# EasyEDA Pro project ProPrj_optical-usb-serial-port-module_2025-04-07.epro

# Schematic Schematic1
Board Name: Board1; Create Date: 2025-04-07; Page Name: P1; Project Name: 光纤USB串口模块; Schematic Name: Schematic1; Update Date: 2025-04-13; Company: 嘉立创EDA; Page Size: A4; Version: V1.0
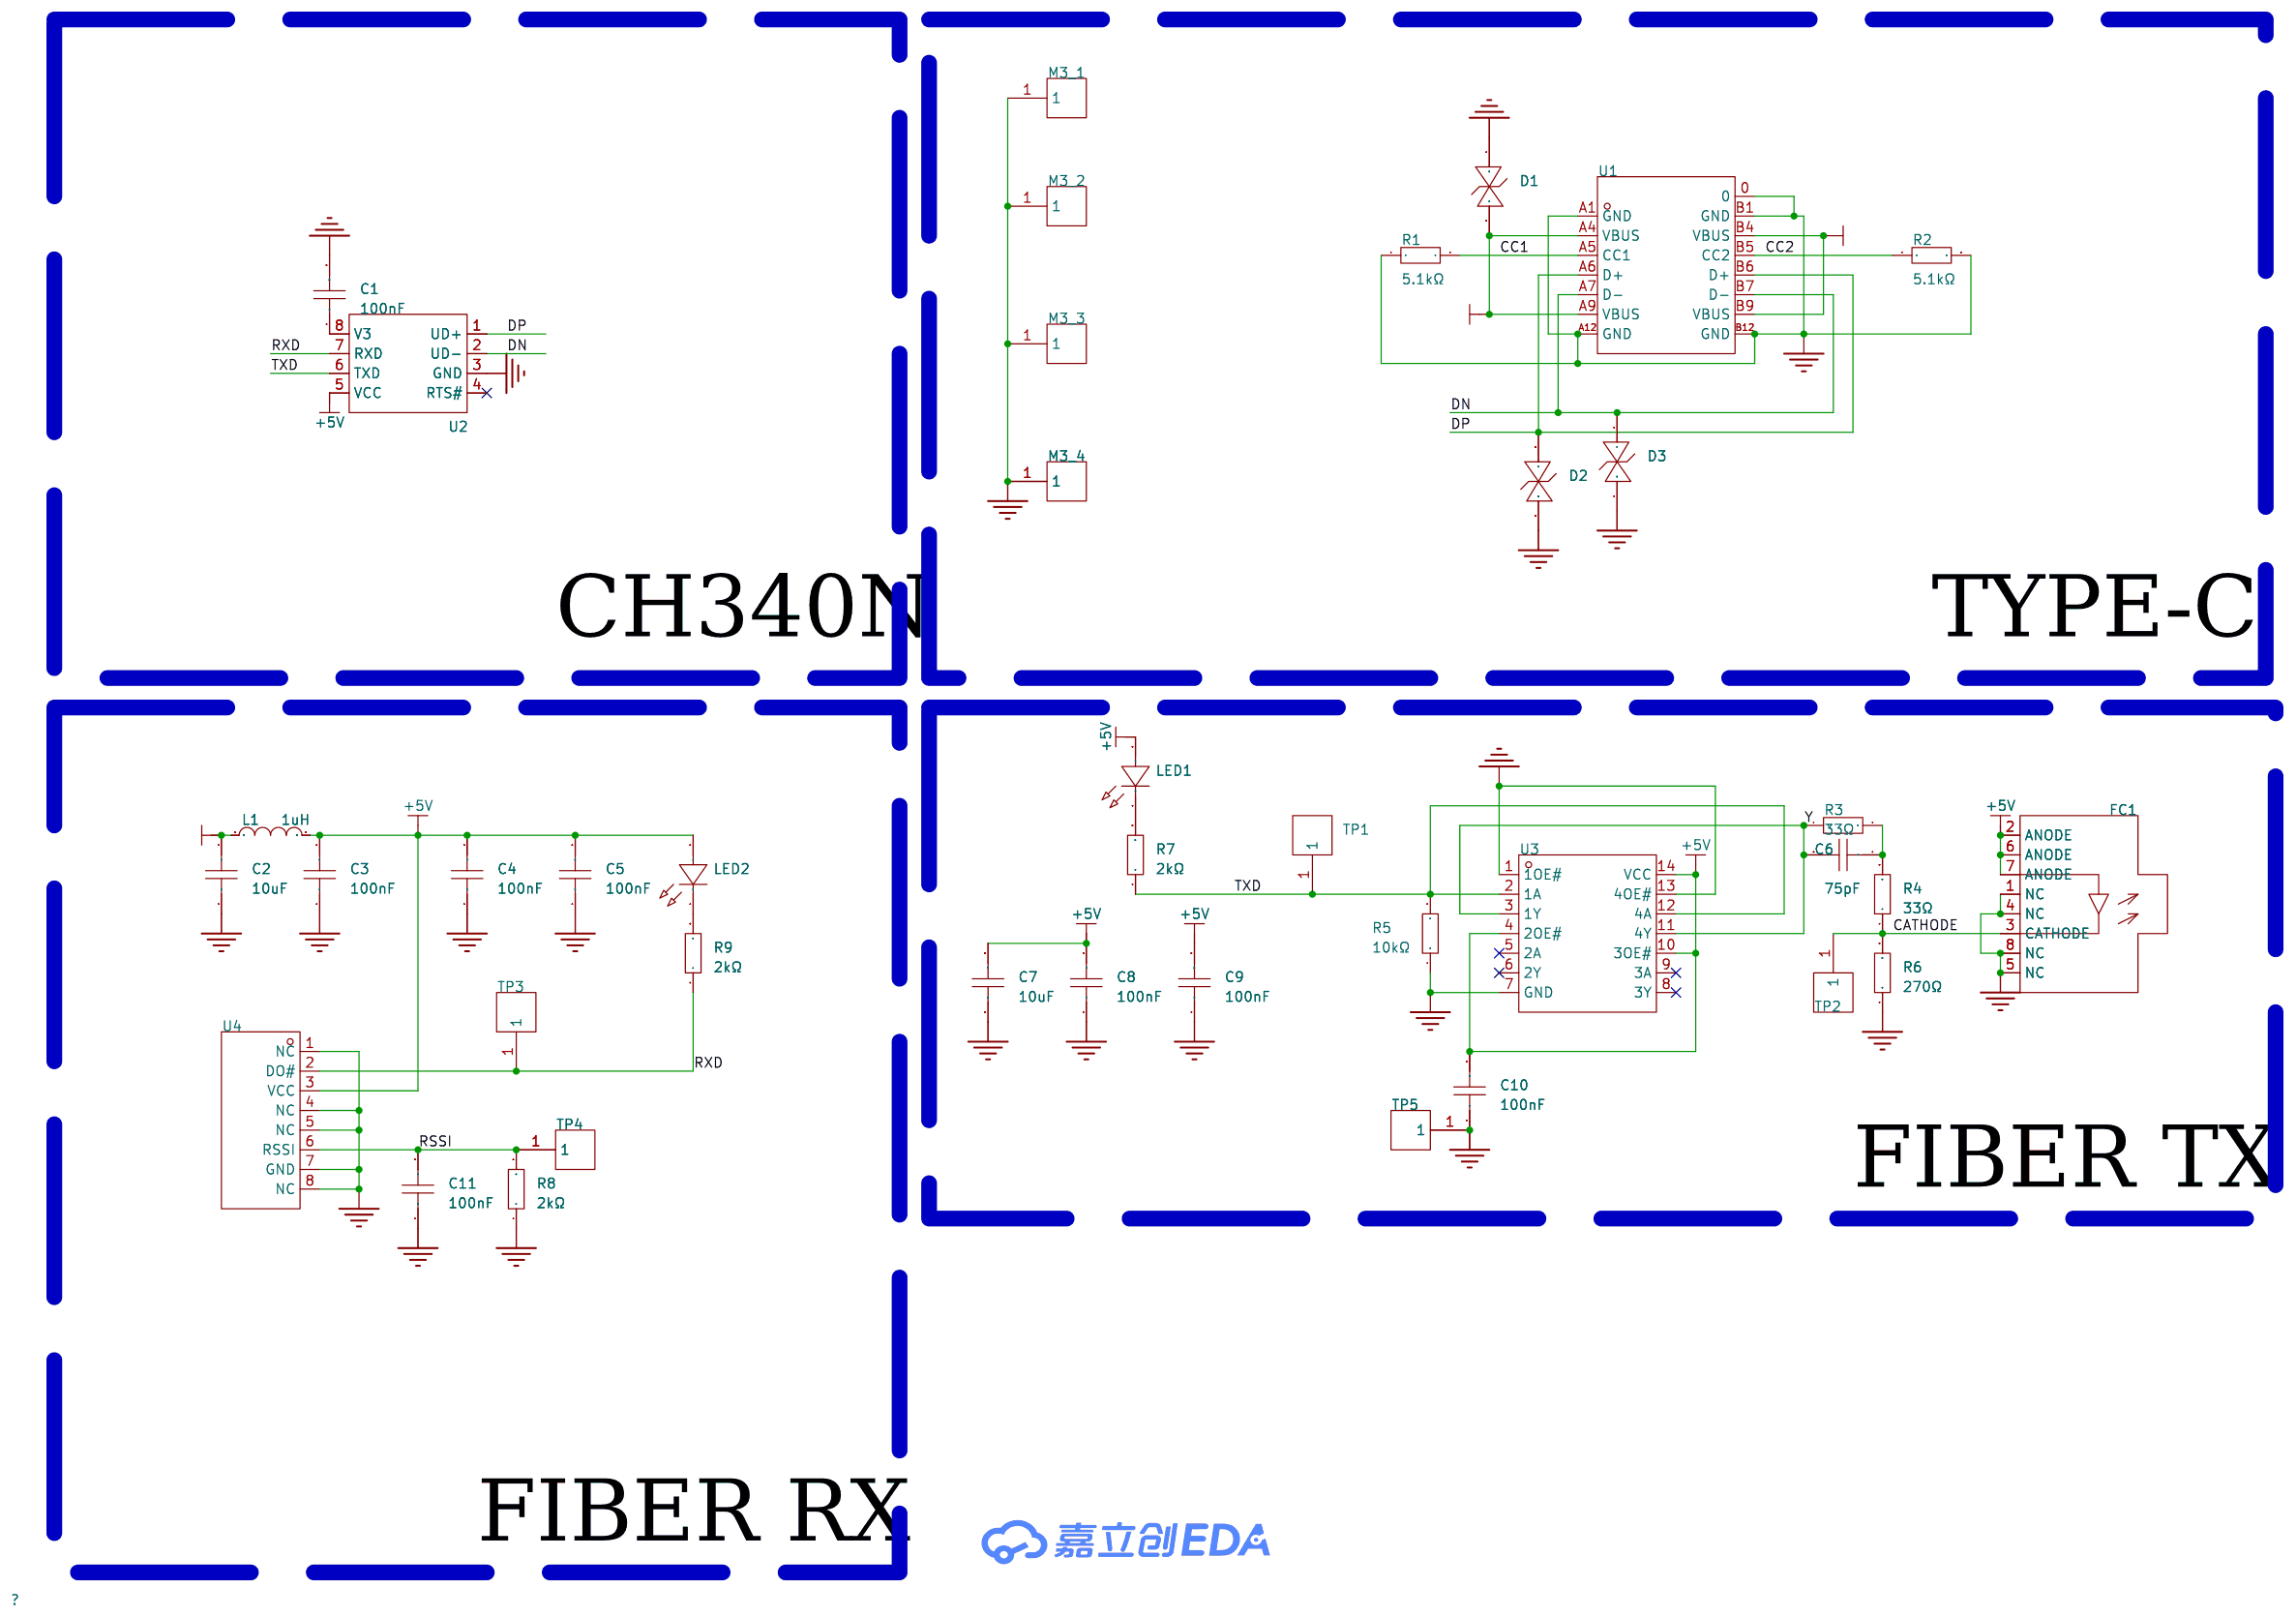
[diagram p0: schematic sheet]

## Parts
C1  100nF  [C0603]
C2  10uF  [C0603]
C3  100nF  [C0603]
C4  100nF  [C0603]
C5  100nF  [C0603]
C6  75pF  [C0603]
C7  10uF  [C0603]
C8  100nF  [C0603]
C9  100nF  [C0603]
C10  100nF  [C0603]
C11  100nF  [C0603]
D1  H5VL10B  [SOD-882_L1.0-W0.6-BI]
D2  H5VL10B  [SOD-882_L1.0-W0.6-BI]
D3  H5VL10B  [SOD-882_L1.0-W0.6-BI]
FC1  HFBR-1414Z  [COMM-TH_HFBR-1414TZ]
L1  1uH  [L0805]
LED1  XL-1608UGC-04  [LED0603-RD_GREEN]
LED2  XL-1608UGC-04  [LED0603-RD_GREEN]
M3_1  M3X5.5X8+4*1.5贴片螺母  [SMD_BD5.5-D3.9]
M3_2  M3X5.5X8+4*1.5贴片螺母  [SMD_BD5.5-D3.9]
M3_3  M3X5.5X8+4*1.5贴片螺母  [SMD_BD5.5-D3.9]
M3_4  M3X5.5X8+4*1.5贴片螺母  [SMD_BD5.5-D3.9]
R1  5.1kΩ  [R0603]
R2  5.1kΩ  [R0603]
R3  33Ω  [R0603]
R4  33Ω  [R0603]
R5  10kΩ  [R0603]
R6  270Ω  [R0603]  (no BOM)
R7  2kΩ  [R0603]
R8  2kΩ  [R0603]
R9  2kΩ  [R0603]
TP1  RH-5000  [TEST-TH_BD2.54-P1.4_RED]
TP2  RH-5000  [TEST-TH_BD2.54-P1.4_RED]
TP3  RH-5000  [TEST-TH_BD2.54-P1.4_RED]
TP4  RH-5000  [TEST-TH_BD2.54-P1.4_RED]
TP5  RH-5000  [TEST-TH_BD2.54-P1.4_RED]
U1  TYPE-C 14PLC-H10.0  [USB-C-TH_SHOUHAN_TYPE-C-14PLC-H10.0]
U2  CH340N  [SOP-8_L4.9-W3.9-P1.27-LS6.0-BL]
U3  SN74ABT125DR  [SOIC-14_L8.7-W3.9-P1.27-LS6.0-BL]
U4  AFBR-2418TZ  [OPTO-TH_AVAGO_AFBR-2418TZ]

## Library data of the parts
C1 C3-C5 C8-C11 = CGA0603X7R104K500JT: 容值:100nF;精度:±10%;额定电压:50V;材质(温度系数):X7R;; LCSC Part Name: 100nF ±10% 50V; Supplier Part: C6119867; Manufacturer: HRE(芯声); Supplier Footprint: 0603; JLCPCB Part Class: 扩展库; Supplier: LCSC; Tolerance: ±10%; Voltage Rated: 50V; Temperature Coefficient: X7R
C2 C7 = CGA0603X5R106K100JT: 容值:10uF;精度:±10%;额定电压:10V;材质(温度系数):X5R;; LCSC Part Name: 10uF ±10% 10V; Supplier Part: C6119842; Manufacturer: HRE(芯声); Supplier Footprint: 0603; JLCPCB Part Class: 扩展库; Supplier: LCSC; Tolerance: ±10%; Voltage Rated: 10V; Temperature Coefficient: X5R
C6 = CC0603JRNPO9BN750: 容值:75pF;精度:±5%;额定电压:50V;材质(温度系数):NP0;; LCSC Part Name: 75pF ±5% 50V; Supplier Part: C282074; Manufacturer: YAGEO(国巨); Supplier Footprint: 0603; JLCPCB Part Class: 扩展库; Datasheet: https://atta.szlcsc.com/upload/public/pdf/source/20181008/C309499_21CC21451B82C39E3D92150FD6B30293.pdf; Supplier: LCSC; Tolerance: ±5%; Voltage Rated: 50V; Temperature Coefficient: NP0
D1-D3 = H5VL10B: 极性:双向;反向截止电压(Vrwm):5V;最大钳位电压:10V;峰值脉冲电流(Ipp):5A;峰值脉冲功率(Ppp):50W;击穿电压:5.6V;; LCSC Part Name: H5VL10B 丝印 PB; Supplier Part: C7420372; Manufacturer: 宏迦橙; Supplier Footprint: DFN1006-2L; JLCPCB Part Class: 扩展库; Datasheet: https://atta.szlcsc.com/upload/public/pdf/source/20230630/5024ECFEAD3C9801B07A8DBB967AB462.pdf; Supplier: LCSC; polarity: 双向; Reverse Stand-Off Voltage (Vrwm): 5V; Maximum Clamping Voltage: 10V; Peak Pulse Current (Ipp): 5A; Peak Pulse Power Dissipation (Ppp): 50W; Breakdown Voltage: 5.6V; Reverse Leakage Current (Ir): 100nA; Number of Lines: 单路; Operating Temperature: -55℃~+155℃; Type: ESD
FC1 = HFBR-1414Z: 类型:光纤接收模块;; LCSC Part Name: 光纤接收模块; Supplier Part: C188711; Manufacturer: Broadcom/AVAGO(安华高); Supplier Footprint: 插件; JLCPCB Part Class: 扩展库; Datasheet: https://atta.szlcsc.com/upload/public/pdf/source/20180327/C188711_340657B1FB13F083D005F17F2456942A.pdf; Supplier: LCSC; Type: 光纤接收模块
L1 = FTC201208S1R0MBCD: 电感值:1uH;精度:±20%;额定电流:3.2A;饱和电流(Isat):3.2A;类型:一体成型电感;; LCSC Part Name: 1uH ±20% 3.2A; Supplier Part: C22400402; Manufacturer: cjiang(长江微电); Supplier Footprint: 0805; JLCPCB Part Class: 扩展库; Datasheet: https://atta.szlcsc.com/upload/public/pdf/source/20240521/31795BC3CA2D650C4BBEFBCA4AFA5344.pdf; Supplier: LCSC; Tolerance: ±20%; Rated Current: 3.2A; Saturation Current (Isat): 3.2A; DC Resistance (DCR): 48mΩ; Type: 一体成型电感
LED1 LED2 = XL-1608UGC-04: 灯头类型:-;发光颜色:翠绿色;正向电压(VF):-;功率:80mW;正向电流:25mA;主波长:516nm~525nm;二极管配置:独立二极管;透镜颜色:无色透明透镜;色温:-;发光强度:-;发光角度:120°;载带方式:正贴;工作温度:-30℃~+85℃;; Supplier Part: C965804; Manufacturer: XINGLIGHT(成兴光); Supplier Footprint: 0603; JLCPCB Part Class: 扩展库; Datasheet: https://atta.szlcsc.com/upload/public/pdf/source/20221102/520D6E465E5CFD1609C8A4DBC80D4018.pdf; Supplier: LCSC; Emitted Color: 翠绿色; Power Dissipation: 80mW; Forward Current: 25mA; Dominant Wavelength: 516nm~525nm; Peak Wavelength: 534nm; Diode Configuration: 独立二极管; Lens Color: 无色透明透镜; Viewing Angle: 120°; Mounting Sytle: 正贴; Operating Temperature: -30℃~+85℃
M3_1-M3_4 = M3X5.5X8+4*1.5贴片螺母: Supplier Part: C9900025424; Supplier Footprint: M3X5.5X8+4*1.5; JLCPCB Part Class: 扩展库; Supplier: LCSC
R1 R2 = 0603WAF5101T5E: 电阻类型:厚膜电阻;阻值:5.1kΩ;精度:±1%;功率:100mW;最大工作电压:75V;温度系数:±100ppm/℃;; LCSC Part Name: 5.1kΩ ±1% 100mW 厚膜电阻; Supplier Part: C23186; Manufacturer: UNI-ROYAL(厚声); Supplier Footprint: 0603; JLCPCB Part Class: 基础库; Datasheet: https://atta.szlcsc.com/upload/public/pdf/source/20200306/C422600_1E6D84923E4A46A82E41ADD87F860B5C.pdf; Supplier: LCSC; Type: 厚膜电阻; Tolerance: ±1%; Power(Watts): 100mW; Overload Voltage (Max): 75V; Temperature Coefficient: ±100ppm/℃; Operating Temperature Range: -55℃~+155℃
R3 R4 = 0603WAF330JT5E: 电阻类型:厚膜电阻;阻值:33Ω;精度:±1%;功率:100mW;最大工作电压:75V;温度系数:±100ppm/℃;; LCSC Part Name: 33Ω ±1% 100mW 厚膜电阻; Supplier Part: C23140; Manufacturer: UNI-ROYAL(厚声); Supplier Footprint: 0603; JLCPCB Part Class: 基础库; Datasheet: https://atta.szlcsc.com/upload/public/pdf/source/20200306/C422600_1E6D84923E4A46A82E41ADD87F860B5C.pdf; Supplier: LCSC; Type: 厚膜电阻; Tolerance: ±1%; Power(Watts): 100mW; Overload Voltage (Max): 75V; Temperature Coefficient: ±100ppm/℃; Operating Temperature Range: -55℃~+155℃
R5 = 0603WAF1002T5E: 电阻类型:厚膜电阻;阻值:10kΩ;精度:±1%;功率:100mW;最大工作电压:75V;温度系数:±100ppm/℃;; LCSC Part Name: 厚膜电阻 10kΩ ±1% 100mW; Supplier Part: C25804; Manufacturer: UNI-ROYAL(厚声); Supplier Footprint: 0603; Datasheet: https://atta.szlcsc.com/upload/public/pdf/source/20200306/C422600_1E6D84923E4A46A82E41ADD87F860B5C.pdf; Supplier: LCSC; Type: 厚膜电阻; Tolerance: ±1%; Power(Watts): 100mW; Overload Voltage (Max): 75V; Temperature Coefficient: ±100ppm/℃; Operating Temperature Range: -55℃~+155℃
R6 = 0603WAF2700T5E: 电阻类型:厚膜电阻;阻值:270Ω;精度:±1%;功率:100mW;最大工作电压:75V;温度系数:±100ppm/℃;; LCSC Part Name: 270Ω ±1% 100mW 厚膜电阻; Supplier Part: C22966; Manufacturer: UNI-ROYAL(厚声); Supplier Footprint: 0603; JLCPCB Part Class: 基础库; Datasheet: https://atta.szlcsc.com/upload/public/pdf/source/20200306/C422600_1E6D84923E4A46A82E41ADD87F860B5C.pdf; Supplier: LCSC; Type: 厚膜电阻; Tolerance: ±1%; Power(Watts): 100mW; Overload Voltage (Max): 75V; Temperature Coefficient: ±100ppm/℃; Operating Temperature Range: -55℃~+155℃
R7-R9 = 0603WAF2001T5E: 电阻类型:厚膜电阻;阻值:2kΩ;精度:±1%;功率:100mW;最大工作电压:75V;温度系数:±100ppm/℃;; LCSC Part Name: 2kΩ ±1% 100mW 厚膜电阻; Supplier Part: C22975; Manufacturer: UNI-ROYAL(厚声); Supplier Footprint: 0603; JLCPCB Part Class: 基础库; Datasheet: https://atta.szlcsc.com/upload/public/pdf/source/20200306/C422600_1E6D84923E4A46A82E41ADD87F860B5C.pdf; Supplier: LCSC; Type: 厚膜电阻; Tolerance: ±1%; Power(Watts): 100mW; Overload Voltage (Max): 75V; Temperature Coefficient: ±100ppm/℃; Operating Temperature Range: -55℃~+155℃
TP1-TP5 = RH-5000: LCSC Part Name: PCB电路板测试点/测试针; Supplier Part: C5277086; Manufacturer: 荣和; JLCPCB Part Class: 扩展库; Datasheet: https://atta.szlcsc.com/upload/public/pdf/source/20230704/1671C2774A3D6CEDC1FD6AAF48538C87.pdf; Supplier: LCSC
U1 = TYPE-C 14PLC-H10.0: 连接器类型:Type-C;标准:USB 3.1;公母:母;安装方式:直插;触点数量:14P;端口数量:1;额定电流 - 电源:5A;触头材质:-;触头镀层:-;工作温度范围:-40℃~+85℃;; LCSC Part Name: Type-C 母 直插; Supplier Part: C3151746; Manufacturer: SHOU HAN(首韩); Supplier Footprint: 插件; JLCPCB Part Class: 扩展库; Datasheet: https://atta.szlcsc.com/upload/public/pdf/source/20220627/CFB3153B5198106DD3F3B6B367CF40F3.pdf; Supplier: LCSC; Connector Type: Type-C; Standard: USB 3.1; Gender: 母; Mounting Style: 直插; Number of Contacts: 14P; Number of Ports: 1; Current Rating - Power (Max): 5A; Operating Temperature Range: -40℃~+85℃; Rated Voltage (Max): 20V; Connect-Disconnect Life: 1万次; Core Colour: 黑色
U2 = CH340N: 应用功能:USB转串口;接口协议:USB 2.0;通道数:1;数据速率:2Mbps;; LCSC Part Name: USB2.0芯片CH340; Supplier Part: C2977777; Manufacturer: WCH(南京沁恒); Supplier Footprint: SOP-8; JLCPCB Part Class: 扩展库; Datasheet: https://atta.szlcsc.com/upload/public/pdf/source/20240313/115CDE92081B1D6CB446704AD5D0F5F2.pdf; Supplier: LCSC; Applications Function: USB转串口; Protocol: USB 2.0; Number of Channels: 1; Voltage - Supply: 3.3V；5V; Data Rate: 2Mbps; Operating Temperature: -20℃~+70℃
U3 = SN74ABT125DR: 输入类型:-;电源电压:4.5V~5.5V;元件数:4;每个元件位数:1;灌电流(IOL):64mA;拉电流(IOH):32mA;; Supplier Part: C544863; Manufacturer: TI(德州仪器); Supplier Footprint: SOIC-14; JLCPCB Part Class: 扩展库; Datasheet: https://www.ti.com/cn/lit/gpn/sn74abt125; Supplier: LCSC; output type: 三态; Supply Voltage: 4.5V~5.5V; Number of Elements: 4; Number of Bits per Element: 1; Sink Current: 64mA; Source Current: 32mA; Logic Family: 74ABT; Operating Temperature: -40℃~+85℃
U4 = AFBR-2418TZ: 类型:光纤接收器;; LCSC Part Name: 光纤接收器; Supplier Part: C691981; Manufacturer: Broadcom/AVAGO(安华高); JLCPCB Part Class: 扩展库; Datasheet: https://atta.szlcsc.com/upload/public/pdf/source/20200630/C691981_1787B816A0EBE74BBFCAA7EC7E1DFD51.pdf; Supplier: LCSC; Type: 光纤接收器

## Nets
+5V: C3.2 C4.2 C5.2 C7.2 C8.2 C9.2 C10.2 FC1.2(ANODE) FC1.6(ANODE) FC1.7(ANODE) L1.2 LED1.2(A) LED2.2(A) U2.5(VCC) U3.4(2OE#) U3.10(3OE#) U3.14(VCC) U4.3(VCC)
GND: C1.2 C2.1 C3.1 C4.1 C5.1 C7.1 C8.1 C9.1 C10.1 C11.1 D1.1(C) D2.1(C) D3.1(C) FC1.1(NC) FC1.4(NC) FC1.5(NC) FC1.8(NC) M3_1.1 M3_2.1 M3_3.1 M3_4.1 R1.1 R2.2 R5.1 R6.1 R8.1 TP5.1 U1.0 U1.A1(GND) U1.A12(GND) U1.B1(GND) U1.B12(GND) U2.3(GND) U3.1(1OE#) U3.7(GND) U3.13(4OE#) U4.1(NC) U4.4(NC) U4.5(NC) U4.7(GND) U4.8(NC)
CATHODE: FC1.3(CATHODE) R4.1 R6.2 TP2.1
CC1: R1.2 U1.A5(CC1)
CC2: R2.1 U1.B5(CC2)
DN: D3.2(A) U1.A7(D-) U1.B7(D-) U2.2(UD-)
DP: D2.2(A) U1.A6(D+) U1.B6(D+) U2.1(UD+)
RSSI: C11.2 R8.2 TP4.1 U4.6(RSSI)
RXD: R9.1 TP3.1 U2.7(RXD) U4.2(DO#)
TXD: R5.2 R7.1 TP1.1 U2.6(TXD) U3.2(1A) U3.12(4A)
VUSB: C2.2 D1.2(A) L1.1 U1.A4(VBUS) U1.A9(VBUS) U1.B4(VBUS) U1.B9(VBUS)
Y: C6.2 R3.1 U3.3(1Y) U3.11(4Y)
$1N2165: LED1.1(K) R7.2
$1N2186: C6.1 R3.2 R4.2
$1N2542: C1.1 U2.8(V3)
$1N8726: LED2.1(K) R9.2

Not connected (* = marked no-connect by the designer): U2 4(RTS#)*; U3 5(2A)* 6(2Y)* 8(3Y)* 9(3A)*

## Notes on the sheet
- CH340N
- TYPE-C
- FIBER TX
- FIBER RX

# Board PCB1
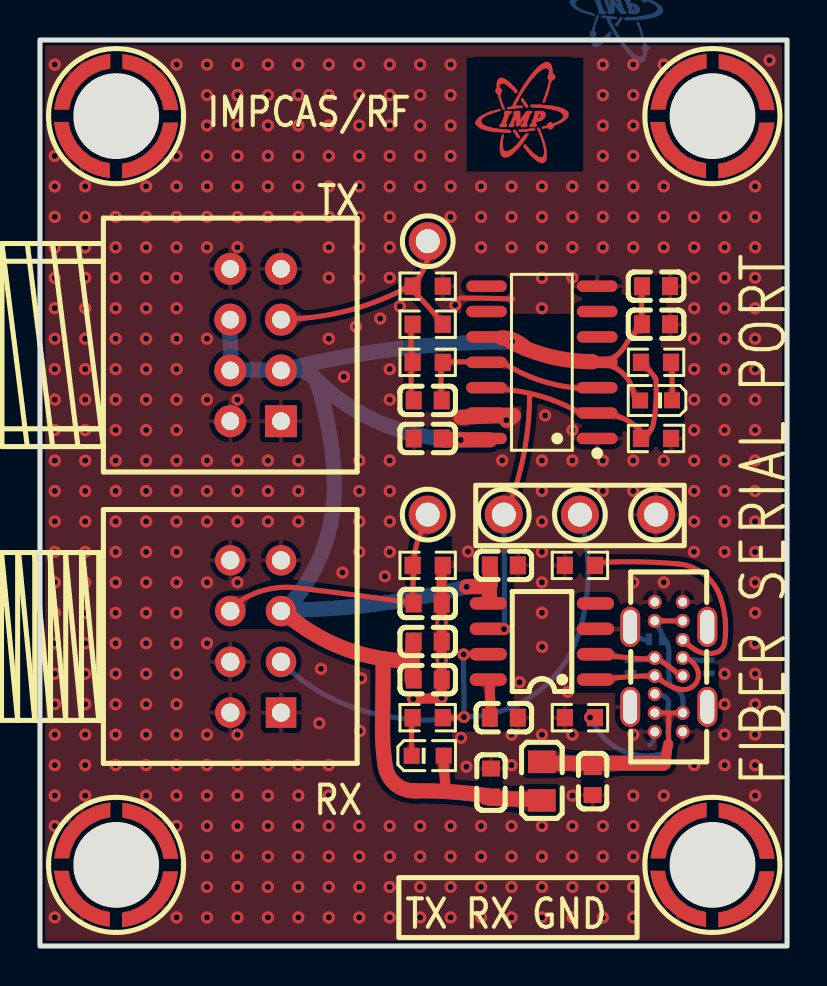
[diagram p1: board, top side]
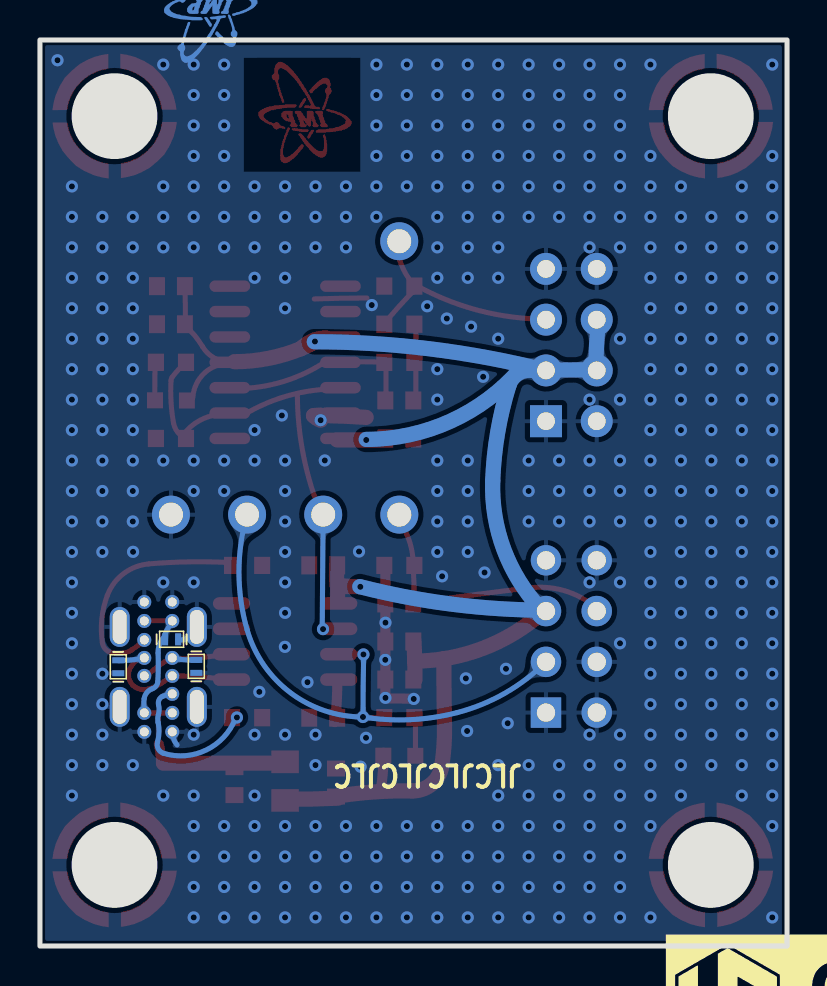
[diagram p2: board, bottom side, seen from below]

Outline 37.39 x 45.33 mm; copper layers: Top Layer, Bottom Layer. Coordinates in mm from the lower left corner of the outline.
Outline path: rectangle 0,45.33 37.39,0
Stack: Top Layer 0.035mm / Dielectric1 1.51mm FR4 er 4.5 / Bottom Layer 0.035mm

## Design rules (mm)
template: JLCPCB Capability(Two Layers Board)
spacing copperThickness1oz (default): track to track 0.102, other pairs 0.152 to 0.3
spacing copperThickness2oz: track to track 0.203, other pairs 0.152 to 0.3
track width copperThickness1oz (default): min 0.127, default 0.254, max 2.54
track width copperThickness2oz: min 0.203, default 0.254, max 2.54
differential pair differentialPair (default): width min 0.127, default 0.254, max 2.54; gap min 0.152, default 0.152
via viaSize (default): diameter min 0.5, default 0.61, max 10; hole min 0.3, default 0.305, max 6.3

## Placement (name value [footprint] x y rotation side)
C1  100nF  [C0603]  23.22 11.43 0 top
C2  10uF  [C0603]  27.66 8.25 90 top
C3  100nF  [C0603]  22.57 8.18 270 top
C4  100nF  [C0603]  19.41 15.24 180 top
C5  100nF  [C0603]  19.41 13.33 180 top
C6  75pF  [C0603]  19.41 27.3 0 top
C7  10uF  [C0603]  30.84 33.02 180 top
C8  100nF  [C0603]  23.22 19.05 180 top
C9  100nF  [C0603]  19.41 25.4 0 top
C10  100nF  [C0603]  30.84 31.11 180 top
C11  100nF  [C0603]  19.41 17.14 180 top
D1  H5VL10B  [SOD-882_L1.0-W0.6-BI]  30.8 15.35 0 bottom
D2  H5VL10B  [SOD-882_L1.0-W0.6-BI]  33.47 13.97 90 bottom
D3  H5VL10B  [SOD-882_L1.0-W0.6-BI]  29.57 13.99 90 bottom
FC1  HFBR-1414Z  [COMM-TH_HFBR-1414TZ]  10.8 30.07 180 top
L1  1uH  [L0805]  25.12 8.25 270 top
LED1  XL-1608UGC-04  [LED0603-RD_GREEN]  30.84 27.3 180 top
LED2  XL-1608UGC-04  [LED0603-RD_GREEN]  19.41 9.52 0 top
M3_1  M3X5.5X8+4*1.5贴片螺母  [SMD_BD5.5-D3.9]  33.66 41.52 0 top
M3_2  M3X5.5X8+4*1.5贴片螺母  [SMD_BD5.5-D3.9]  33.66 4.06 0 top
M3_3  M3X5.5X8+4*1.5贴片螺母  [SMD_BD5.5-D3.9]  3.81 4.06 0 top
M3_4  M3X5.5X8+4*1.5贴片螺母  [SMD_BD5.5-D3.9]  3.81 41.52 0 top
R1  5.1kΩ  [R0603]  27.03 11.43 0 top
R2  5.1kΩ  [R0603]  27.03 19.05 180 top
R3  33Ω  [R0603]  19.41 29.21 180 top
R4  33Ω  [R0603]  19.41 31.11 180 top
R5  10kΩ  [R0603]  30.84 25.4 180 top
R6  270Ω  [R0603]  19.41 33.02 180 top
R7  2kΩ  [R0603]  30.84 29.21 0 top
R8  2kΩ  [R0603]  19.41 19.05 180 top
R9  2kΩ  [R0603]  19.41 11.43 180 top
TP1  RH-5000  [TEST-TH_BD2.54-P1.4_RED]  23.22 21.59 270 top
TP2  RH-5000  [TEST-TH_BD2.54-P1.4_RED]  19.41 35.26 180 top
TP3  RH-5000  [TEST-TH_BD2.54-P1.4_RED]  27.03 21.59 90 top
TP4  RH-5000  [TEST-TH_BD2.54-P1.4_RED]  19.41 21.59 270 top
TP5  RH-5000  [TEST-TH_BD2.54-P1.4_RED]  30.84 21.59 90 top
U1  TYPE-C 14PLC-H10.0  [USB-C-TH_SHOUHAN_TYPE-C-14PLC-H10.0]  31.47 13.97 90 top
U2  CH340N  [SOP-8_L4.9-W3.9-P1.27-LS6.0-BL]  25.12 15.24 90 top
U3  SN74ABT125DR  [SOIC-14_L8.7-W3.9-P1.27-LS6.0-BL]  25.12 29.21 90 top
U4  AFBR-2418TZ  [OPTO-TH_AVAGO_AFBR-2418TZ]  10.8 15.49 270 top

## Footprints (pads in the part's own frame, mm; a bottom-side part is the same pattern mirrored in y, then rotated)
C0603
  rect 0.8x0.9 smd: 1(-0.7,0) 2(0.7,0)
COMM-TH_HFBR-1414TZ
  rect 1.6x1.6 hole 0.889: 1(-1.27,3.81)
  round 1.6 hole 0.889: 2(-1.27,1.27) 3(-1.27,-1.27) 4(-1.27,-3.81) 5(1.27,-3.81) 6(1.27,-1.27) 7(1.27,1.27) 8(1.27,3.81)
L0805
  rect 1.133x1.377 smd: 1(-0.966,0) 2(0.966,0)
LED0603-RD_GREEN
  rect 0.8x0.8 smd: 1(-0.799,-0.004) 2(0.799,0.004)
OPTO-TH_AVAGO_AFBR-2418TZ
  rect 1.524x1.524 hole 0.914: 1(3.81,1.27)
  round 1.524 hole 0.914: 2(1.27,1.27) 3(-1.27,1.27) 4(-3.81,1.27) 5(-3.81,-1.27) 6(-1.27,-1.27) 7(1.27,-1.27) 8(3.81,-1.27)
R0603
  rect 0.806x0.864 smd: 1(-0.753,0) 2(0.753,0)
SMD_BD5.5-D3.9
  custom 2.801x2.812 smd: 1(-1.714,-2.131)
  custom 2.812x2.801 smd: 1(-1.691,2.155)
  custom 2.812x2.802 smd: 1(1.701,-2.155)
  custom 2.802x2.812 smd: 1(1.714,2.141)
SOD-882_L1.0-W0.6-BI
  rect 0.3x0.6 smd: 1(-0.325,0) 2(0.325,0)
SOIC-14_L8.7-W3.9-P1.27-LS6.0-BL
  oval 0.574x2.038 smd: 1(-3.81,-2.769) 2(-2.54,-2.769) 3(-1.27,-2.769) 4(0,-2.769) 5(1.27,-2.769) 6(2.54,-2.769) 7(3.81,-2.769) 8(3.81,2.769) 9(2.54,2.769) 10(1.27,2.769) 11(0,2.769) 12(-1.27,2.769) 13(-2.54,2.769) 14(-3.81,2.769)
SOP-8_L4.9-W3.9-P1.27-LS6.0-BL
  oval 0.63x1.865 smd: 1(-1.905,-2.683) 2(-0.635,-2.683) 3(0.635,-2.683) 4(1.905,-2.683) 5(1.905,2.683) 6(0.635,2.683) 7(-0.635,2.683) 8(-1.905,2.683)
TEST-TH_BD2.54-P1.4_RED
  round 1.9 hole 1.2: 1(0,0)
USB-C-TH_SHOUHAN_TYPE-C-14PLC-H10.0
  oval 2x1 hole 1.7x0.7: 0(-2,1.93) 0(-2,-1.93) 0(2,1.93) 0(2,-1.93)
  round 0.7 hole 0.45: A1(-3.25,0.7) A4(-2.3,0.7) A5(-1.35,0.7) A6(-0.45,0.7) A7(0.45,0.7) A9(2.3,0.7) A12(3.25,0.7) B1(3.25,-0.7) B4(2.3,-0.7) B5(1.35,-0.7) B6(0.45,-0.7) B7(-0.45,-0.7) B9(-2.3,-0.7) B12(-3.25,-0.7)

## Nets
As in the schematic.

Pads without a net: U2 4; U3 5 6 8 9

## Via types
v1: diameter 0.61, hole 0.305, Top Layer to Bottom Layer, 411 vias

## Routing (per net, layer and track width the routed paths; a pad name or vN(x,y) marks a point on that pad's centre or on a via; arc(x,y) is an arc through that point)
+5V: length 92.8
  Top Layer w0.254: 30.11,31.02 arc(30.12,32.02) 30.13,33.02 ; 30.11,31.02 arc(30.19,31.09) 30.28,31.16 ; 30.11,31.02 arc(29.64,30.54) 29.25,29.99 arc(28.68,29.43) 27.9,29.22 ; 30.11,31.02 arc(30.11,30.99) 30.11,30.96 ; 27.92,29.15 arc(29.17,28.66) 29.74,27.45
  Top Layer w0.508: 20.19,9.67 arc(20.23,8.75) 20.33,7.84
  Top Layer w0.762: 20.21,25.36 20.25,25.33 22.52,25.33 ; 18.63,14.25 arc(18.65,14.77) 18.68,15.29 ; 18.63,14.25 arc(18.62,13.79) 18.62,13.33 ; 18.63,14.25 arc(17.9,14.29) 17.18,14.37 ; 21.88,17.99 arc(22.18,17.98) 22.47,17.95 ; 21.88,17.99 arc(21.62,17.99) v1(21.36,17.97) ; 21.88,17.99 arc(22.2,18.02) 22.52,18.06 arc(22.55,18.56) 22.52,19.05 ; 22.51,7.5 arc(20.64,7.71) 18.76,7.76 arc(17.78,8.11) 17.28,9.01 arc(17.17,10.03) 17.15,11.04 arc(17.17,12.71) 17.18,14.37 ; 25.1,7.34 arc(23.79,7.35) 22.48,7.4 ; 27.66,29.24 arc(25.96,29.4) 24.33,29.89 ; 24.33,29.89 arc(24.02,30.14) 23.66,30.32 arc(23.38,30.39) 23.1,30.43 ; 24.33,29.89 arc(23.97,30.04) 23.61,30.22 ; 17.18,14.37 arc(14.51,15.2) 12.19,16.74 ; 22.48,17.95 arc(22.5,17.62) 22.47,17.28
  Bottom Layer w0.508: 12.12,16.83 arc(12.23,16.86) 12.35,16.88
  Bottom Layer w0.762: 12.13,28.82 9.57,28.83 ; 9.57,28.83 9.35,28.84 ; 9.57,28.83 arc(9.53,30.08) 9.43,31.33 ; 9.57,28.83 arc(9.57,28.8) 9.57,28.76 ; 12.03,16.8 arc(16.74,17.1) 21.38,17.98 ; 21.06,25.35 arc(16.83,26.27) 13.35,28.86 ; 12.75,28.8 arc(13.47,28.64) 13.92,28.05 arc(14.49,25.69) 14.73,23.27 arc(14.17,19.84) 12.35,16.88 ; 23.66,30.23 arc(17.86,29.88) 12.14,28.82
  vias: v1(21.06,25.32) v1(23.63,30.25)
GND: length 15.2
  Top Layer w0.254: 21.03,32.42 arc(22.34,32.41) 23.66,32.38
  Top Layer w0.508: 20.1,12.39 20.1,19.14 ; 20.1,12.39 20.1,12.37 ; 20.1,12.39 arc(19.36,12.38) 18.62,12.37 ; 20.1,12.39 arc(20.11,12.39) 20.13,12.39
  Top Layer w0.762: 22.9,26.53 arc(21.98,26.5) 21.07,26.45 ; v1(23.34,26.31) arc(23.54,26.4) 23.7,26.54 ; 23.7,26.54 arc(23.52,26.56) 23.35,26.56
  Bottom Layer w0.254: 30.73,10.59 arc(30.68,10.31) 30.53,10.06 ; 30.5,15.29 arc(29.95,15.45) 29.57,15.86
  vias: v1(0.74,44.1) v1(0.74,39.53) v1(0.74,38.01) v1(0.74,36.48) v1(0.74,34.96) v1(0.74,33.44) v1(0.74,31.91) v1(0.74,30.39) v1(0.74,28.86) v1(0.74,27.34) v1(0.74,25.82) v1(0.74,24.29) v1(0.74,22.77) v1(0.74,21.24) v1(0.74,19.72) v1(0.74,18.2) v1(0.74,16.67) v1(0.74,15.15) v1(0.74,13.62) v1(0.74,12.1) v1(0.74,10.58) v1(0.74,9.05) v1(0.74,7.53) v1(0.74,6) v1(0.74,1.43) v1(2.26,38.01) v1(2.26,36.48) v1(2.26,34.96) v1(2.26,33.44) v1(2.26,31.91) v1(2.26,30.39) v1(2.26,28.86) v1(2.26,27.34) v1(2.26,25.82) v1(2.26,24.29) v1(2.26,22.77) v1(2.26,21.24) v1(2.26,19.72) v1(2.26,18.2) v1(2.26,16.67) v1(2.26,15.15) v1(2.26,13.62) v1(2.26,12.1) v1(2.26,10.58) v1(2.26,9.05) v1(2.26,7.53) v1(3.79,36.48) v1(3.79,34.96) v1(3.79,33.44) v1(3.79,31.91) v1(3.79,30.39) v1(3.79,28.86) v1(3.79,27.34) v1(3.79,25.82) v1(3.79,24.29) v1(3.79,22.77) v1(3.79,21.24) v1(3.79,19.72) v1(3.79,18.2) v1(3.79,16.67) v1(3.79,15.15) v1(3.79,13.62) v1(3.79,12.1) v1(3.79,10.58) v1(3.79,9.05) v1(5.31,38.01) v1(5.31,36.48) v1(5.31,34.96) v1(5.31,33.44) v1(5.31,31.91) v1(5.31,30.39) v1(5.31,28.86) v1(5.31,27.34) v1(5.31,25.82) v1(5.31,24.29) v1(5.31,22.77) v1(5.31,21.24) v1(5.31,19.72) v1(5.31,18.2) v1(5.31,16.67) v1(5.31,15.15) v1(5.31,13.62) v1(5.31,12.1) v1(5.31,10.58) v1(5.31,9.05) v1(5.31,7.53) v1(6.84,44.1) v1(6.84,39.53) v1(6.84,38.01) v1(6.84,36.48) v1(6.84,34.96) v1(6.84,33.44) v1(6.84,31.91) v1(6.84,30.39) v1(6.84,28.86) v1(6.84,27.34) v1(6.84,25.82) v1(6.84,24.29) v1(6.84,22.77) v1(6.84,21.24) v1(6.84,19.72) v1(6.84,18.2) v1(6.84,16.67) v1(6.84,15.15) v1(6.84,13.62) v1(6.84,12.1) v1(6.84,10.58) v1(6.84,9.05) v1(6.84,7.53) v1(6.84,6) v1(6.84,1.43) v1(8.36,44.1) v1(8.36,42.58) v1(8.36,41.06) v1(8.36,39.53) v1(8.36,38.01) v1(8.36,36.48) v1(8.36,34.96) v1(8.36,30.39) v1(8.36,27.34) v1(8.36,24.29) v1(8.36,22.77) v1(8.36,21.24) v1(8.36,18.2) v1(8.36,15.15) v1(8.36,10.58) v1(8.36,9.05) v1(8.36,7.53) v1(8.36,6) v1(8.36,4.48) v1(8.36,2.96) v1(8.36,1.43) v1(9.88,44.1) v1(9.88,42.58) v1(9.88,41.06) v1(9.88,39.53) v1(9.88,38.01) v1(9.88,36.48) v1(9.88,34.96) v1(9.88,27.34) v1(9.88,24.29) v1(9.88,22.77) v1(9.88,21.24) v1(9.88,18.2) v1(9.88,10.58) v1(9.88,9.05) v1(9.88,7.53) v1(9.88,6) v1(9.88,4.48) v1(9.88,2.96) v1(9.88,1.43) v1(11.41,44.1) v1(11.41,42.58) v1(11.41,41.06) v1(11.41,39.53) v1(11.41,38.01) v1(11.41,36.48) v1(11.41,24.29) v1(11.41,22.77) v1(11.41,21.24) v1(11.41,9.05) v1(11.41,7.53) v1(11.41,6) v1(11.41,4.48) v1(11.41,2.96) v1(11.41,1.43) v1(12.93,44.1) v1(12.93,42.58) v1(12.93,41.06) v1(12.93,39.53) v1(12.93,38.01) v1(12.93,36.48) v1(12.93,24.29) v1(12.93,22.77) v1(12.93,21.24) v1(12.93,9.05) v1(12.93,7.53) v1(12.93,6) v1(12.93,4.48) v1(12.93,2.96) v1(12.93,1.43) v1(13.98,11.15) v1(14.07,13.87) v1(14.46,44.1) v1(14.46,42.58) v1(14.46,41.06) v1(14.46,39.53) v1(14.46,38.01) v1(14.46,36.48) v1(14.46,34.96) v1(14.46,33.44) v1(14.46,30.39) v1(14.46,9.05) v1(14.46,7.53) v1(14.46,6) v1(14.46,4.48) v1(14.46,2.96) v1(14.46,1.43) v1(15.21,28.48) v1(15.14,18.69) v1(15.81,30.99) v1(15.98,44.1) v1(15.98,42.58) v1(15.98,41.06) v1(15.98,39.53) v1(15.98,38.01) v1(15.98,36.48) v1(15.98,34.96) v1(15.98,33.44) v1(15.98,24.29) v1(15.98,22.77) v1(15.98,21.24) v1(15.98,19.72) v1(16.01,10.76) v1(15.98,6) v1(15.98,4.48) v1(15.98,2.96) v1(15.98,1.43) v1(16.07,13.39) v1(17.03,31.4) v1(17.26,18.5) v1(17.5,44.1) v1(17.5,42.58) v1(17.5,41.06) v1(17.5,39.53) v1(17.5,38.01) v1(17.5,36.48) v1(17.5,34.96) v1(17.5,33.44) v1(17.5,28.86) v1(17.5,27.34) v1(17.5,24.29) v1(17.5,22.77) v1(17.5,21.24) v1(17.5,19.72) v1(17.5,6) v1(17.5,4.48) v1(17.5,2.96) v1(17.5,1.43) v1(18.01,32.01) v1(18.68,12.36) v1(19.03,44.1) v1(19.03,42.58) v1(19.03,41.06) v1(19.03,39.53) v1(19.03,38.01) v1(19.03,6) v1(19.03,4.48) v1(19.03,2.96) v1(19.03,1.43) v1(20.1,16.18) v1(20.11,14.32) v1(20.1,12.42) v1(20.55,44.1) v1(20.55,42.58) v1(20.55,41.06) v1(20.55,39.53) v1(20.55,38.01) v1(20.55,36.48) v1(20.55,6) v1(20.55,4.48) v1(20.55,2.96) v1(20.55,1.43) v1(20.78,32.07) v1(21.07,10.42) v1(21.34,8.97) v1(21.42,19.74) v1(22.08,38.01) v1(22.08,36.48) v1(22.08,34.96) v1(22.08,6) v1(22.08,4.48) v1(22.08,2.96) v1(22.08,1.43) v1(23.14,24.3) v1(23.6,38.01) v1(23.6,36.48) v1(23.6,34.96) v1(23.6,10.58) v1(23.6,9.05) v1(23.6,6) v1(23.6,4.48) v1(23.6,2.96) v1(23.6,1.43) v1(24,13.2) v1(25.12,38.01) v1(25.12,36.48) v1(25.12,34.96) v1(25.12,33.44) v1(25.12,31.91) v1(25.12,24.29) v1(25.12,22.77) v1(25.12,21.24) v1(25.12,19.72) v1(25.12,18.2) v1(25.12,16.67) v1(25.13,14.97) v1(25.12,10.58) v1(25.12,6) v1(25.12,4.48) v1(25.12,2.96) v1(25.12,1.43) v1(25.28,26.55) v1(26.41,12.72) v1(26.65,38.01) v1(26.65,36.48) v1(26.65,34.96) v1(26.65,33.44) v1(26.65,25.82) v1(26.65,24.29) v1(26.65,10.58) v1(26.65,7.53) v1(26.65,6) v1(26.65,4.48) v1(26.65,2.96) v1(26.65,1.43) v1(28.17,44.1) v1(28.17,42.58) v1(28.17,41.06) v1(28.17,39.53) v1(28.17,38.01) v1(28.17,36.48) v1(28.17,34.96) v1(28.17,24.29) v1(28.17,22.77) v1(28.17,6) v1(28.17,4.48) v1(28.17,2.96) v1(28.17,1.43) v1(29.7,44.1) v1(29.7,42.58) v1(29.7,41.06) v1(29.7,39.53) v1(29.7,38.01) v1(29.7,36.48) v1(29.7,34.96) v1(29.7,24.29) v1(29.7,22.77) v1(29.7,18.2) v1(29.7,10.58) v1(29.7,7.53) v1(29.7,6) v1(29.7,4.48) v1(29.7,2.96) v1(29.7,1.43) v1(31.22,44.1) v1(31.22,38.01) v1(31.22,36.48) v1(31.22,34.96) v1(31.22,24.29) v1(31.22,18.2) v1(31.22,7.53) v1(32.74,36.48) v1(32.74,34.96) v1(32.74,33.44) v1(32.74,31.91) v1(32.74,30.39) v1(32.74,28.86) v1(32.74,27.34) v1(32.74,25.82) v1(32.74,24.29) v1(32.74,22.77) v1(32.74,21.24) v1(32.73,19.72) v1(32.74,9.05) v1(34.27,36.48) v1(34.27,34.96) v1(34.27,33.44) v1(34.27,31.91) v1(34.27,30.39) v1(34.27,28.86) v1(34.27,27.34) v1(34.27,25.82) v1(34.27,24.29) v1(34.27,22.77) v1(34.27,21.24) v1(34.27,19.72) v1(34.27,13.62) v1(34.27,12.1) v1(34.27,10.58) v1(34.27,9.05) v1(35.79,38.01) v1(35.79,36.48) v1(35.79,34.96) v1(35.79,33.44) v1(35.79,31.91) v1(35.79,30.39) v1(35.79,28.86) v1(35.79,27.34) v1(35.79,25.82) v1(35.79,24.29) v1(35.79,22.77) v1(35.79,21.24) v1(35.79,19.72) v1(35.79,18.2) v1(35.79,16.67) v1(35.79,15.15) v1(35.79,13.62) v1(35.79,12.1) v1(35.79,10.58) v1(35.79,9.05) v1(35.79,7.53) v1(36.51,44.32)
CATHODE: length 12.3
  Top Layer w0.254: 12.04,31.36 arc(15.42,31.8) 18.59,33.07 ; 18.56,32.91 arc(19.46,31.96) 20.3,30.96 ; 18.58,32.98 arc(19.33,34.15) 19.52,35.53
CC1: length 8
  Bottom Layer w0.254: 27.61,11.37 arc(29.07,9.81) 31.2,9.64 arc(31.47,9.86) 31.51,10.21 arc(31.43,10.69) 31.48,11.19 arc(31.5,11.38) 31.47,11.57 arc(31.43,11.82) 31.46,12.07 arc(31.43,12.32) 31.26,12.49 arc(31.03,12.57) 30.78,12.6
  vias: v1(27.53,11.44)
CC2: length 11.9
  Top Layer w0.254: 32.14,15.34 arc(32.45,15.07) 32.78,14.83 arc(33.31,14.64) 33.87,14.69 arc(34.13,14.88) 34.27,15.17 arc(34.3,16.36) 34.03,17.52 arc(33.22,18.63) 31.94,19.12 arc(29.9,19.22) 27.86,19.19
DN: length 5.4
  Top Layer w0.254: 30.8,14.36 arc(29.51,14.41) 28.23,14.58 ; 32.13,13.43 arc(31.5,13.98) 30.8,14.43
  Bottom Layer w0.254: 29.45,14.3 arc(30.04,14.32) 30.62,14.36
DP: length 7.8
  Top Layer w0.254: 30.81,13.54 arc(31.35,13.13) 31.97,12.86 arc(32.31,12.84) 32.63,12.96 arc(32.93,13.34) 32.91,13.83 arc(32.65,14.21) 32.26,14.45 ; 30.74,13.52 arc(29.5,13.48) 28.27,13.36
  Bottom Layer w0.254: 33.47,14.28 arc(32.79,14.32) 32.12,14.42
RSSI: length 13.9
  Top Layer w0.254: 19.36,21.18 arc(18.88,20.19) 18.72,19.11 arc(18.67,18.14) 18.66,17.16 ; 9.31,16.7 arc(10.94,17.72) 12.85,17.92 arc(15.76,17.56) 18.66,17.16 ; 18.66,17.16 arc(18.66,17.15) 18.66,17.13
RXD: length 29
  Top Layer w0.254: 20.24,11.41 arc(20.73,11.42) 21.21,11.46 ; 22.56,14.6 arc(21.89,14.6) 21.23,14.61
  Bottom Layer w0.254: 21.19,14.57 arc(21.19,14.56) 21.19,14.56 arc(21.22,13.01) 21.22,11.46 ; U4.2 arc(14.12,12.65) 16.51,11.68 arc(18.86,11.33) v1(21.23,11.46) arc(24.85,12.67) 27.02,15.81 arc(27.43,18.7) TP3.1
  vias: v1(21.2,14.59)
TXD: length 23
  Top Layer w0.254: 28.18,26.61 arc(29.34,26.33) 30.24,25.54 ; 22.51,27.88 arc(24.9,27.56) 27.12,26.62 ; 30.24,29.07 arc(30.52,28.78) 30.77,28.47 arc(30.81,28.39) 30.83,28.31 arc(30.83,27.24) 30.71,26.17 arc(30.6,25.85) 30.39,25.59 ; 24.51,27.64 arc(24.2,24.53) 23.29,21.55
  Bottom Layer w0.254: 23.26,15.83 23.22,21.54
  vias: v1(23.22,15.86)
VUSB: length 16.8
  Top Layer w0.254: 30.79,11.66 31.46,11.66 ; 31.46,11.66 31.46,10.11 ; 31.46,11.66 31.46,11.68 ; 31.46,11.66 32.11,11.66 32.12,11.68 ; 32.17,16.27 arc(31.46,16.27) 30.76,16.28
  Top Layer w0.508: 31.33,9.15 arc(31.36,9.63) 31.45,10.11
  Top Layer w0.762: 31.21,9.15 24.99,9.15 24.98,9.15
  Bottom Layer w0.254: 31.16,15.47 arc(31.41,15.1) 31.48,14.67 arc(31.47,13.95) 31.49,13.24 arc(31.57,13.02) 31.77,12.88 arc(32.04,12.68) 32.18,12.38 arc(32.19,12.04) 32.12,11.71 ; 31.17,15.29 arc(31.04,15.81) 30.69,16.22
Y: length 8.6
  Top Layer w0.254: 20.07,29.22 20.07,29.24 ; 20.07,29.22 21.91,29.24 ; 20.07,29.22 20.07,27.26 ; 27.57,27.89 arc(25.2,28.25) 23.04,29.28
$1N2165: length 2.2
  Top Layer w0.254: 31.64,29.21 arc(31.64,28.13) 31.66,27.05
$1N2186: length 4.1
  Top Layer w0.254: 18.58,31.18 18.58,27.1
$1N2542: length 2.1
  Top Layer w0.508: 22.51,13.25 arc(22.54,12.23) 22.63,11.21
$1N8726: length 2
  Top Layer w0.254: 18.6,9.43 18.6,11.48

## Copper pours and planes (outline as drawn; the poured copper is in the pictures)
GND on Top Layer: 0,45.33 37.39,45.33 37.39,0 0,0
GND on Bottom Layer: 0,45.33 37.39,45.33 37.39,0 0,0

Small or netless copper shapes (teardrops, artwork), in the pictures only: 99 on Top Layer, 41 on Bottom Layer

## Text on the board
Bottom Silkscreen Layer: JLCJLCJLCJLC
Top Silkscreen Layer: IMPCAS/RF | RX | TX RX GND | TX | FIBER SERIAL PORT
